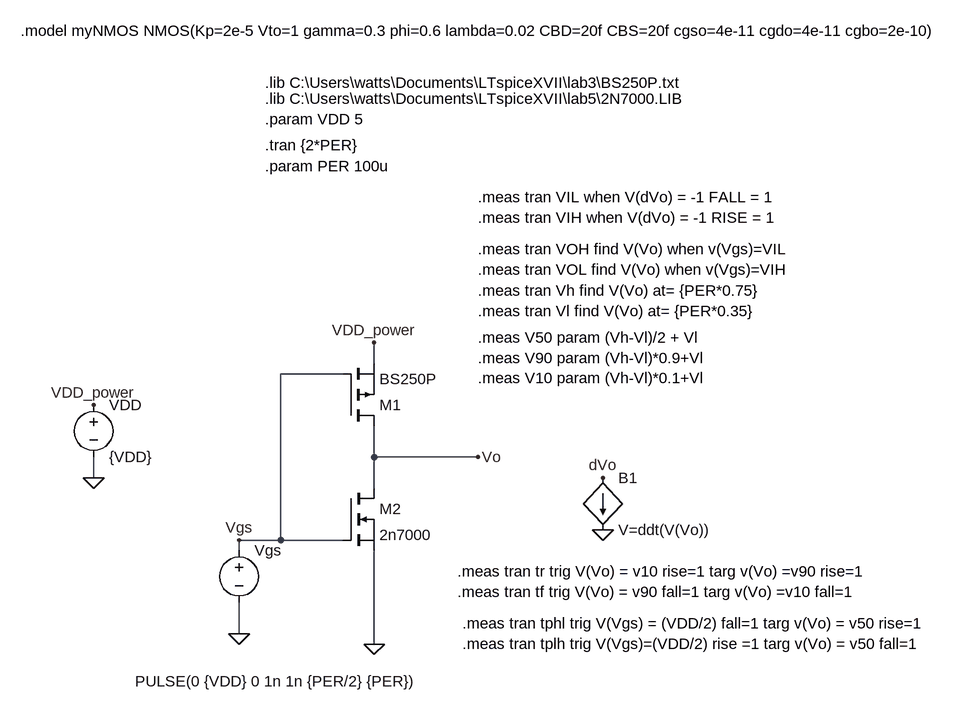
[diagram p0: schematic CMOS_propagation.asc]
CMOS_propagation.asc, the LTspice schematic file:
Version 4
SHEET 1 1272 680
WIRE 272 -96 272 -128
WIRE 224 -80 128 -80
WIRE 272 48 272 0
WIRE 432 48 272 48
WIRE -160 80 -160 48
WIRE 272 96 272 48
WIRE 128 176 128 -80
WIRE 128 176 64 176
WIRE 224 176 128 176
WIRE 64 192 64 176
WIRE 64 320 64 272
WIRE 272 336 272 192
FLAG 64 320 0
FLAG -160 80 0
FLAG -160 -32 VDD_power
FLAG 272 -128 VDD_power
FLAG 432 48 Vo
FLAG 272 336 0
FLAG 624 160 0
FLAG 624 80 dVo
FLAG 64 176 Vgs
SYMBOL voltage 64 176 R0
WINDOW 123 0 0 Left 0
WINDOW 39 0 0 Left 0
WINDOW 3 -160 217 Left 2
SYMATTR Value PULSE(0 {VDD} 0 1n 1n {PER/2} {PER})
SYMATTR InstName Vgs
SYMBOL voltage -160 -48 R0
SYMATTR InstName VDD
SYMATTR Value {VDD}
SYMBOL bi 624 80 R0
SYMATTR InstName B1
SYMATTR Value V=ddt(V(Vo))
SYMBOL nmos 224 96 R0
SYMATTR InstName M2
SYMATTR Value 2n7000
SYMATTR Prefix X
SYMBOL pmos 224 0 M180
SYMATTR InstName M1
SYMATTR Value BS250P
SYMATTR Prefix X
TEXT 104 -504 Left 2 !.lib C:\\Users\\watts\\Documents\\LTspiceXVII\\lab5\\2N7000.LIB
TEXT 104 -472 Left 2 !.param VDD 5
TEXT 104 -432 Left 2 !.tran {2*PER}
TEXT 432 -352 Left 2 !.meas tran VIL when V(dVo) = -1 FALL = 1\n.meas tran VIH when V(dVo) = -1 RISE = 1
TEXT 432 -272 Left 2 !.meas tran VOH find V(Vo) when v(Vgs)=VIL\n.meas tran VOL find V(Vo) when v(Vgs)=VIH
TEXT -272 -608 Left 2 !.model myNMOS NMOS(Kp=2e-5 Vto=1 gamma=0.3 phi=0.6 lambda=0.02 CBD=20f CBS=20f cgso=4e-11 cgdo=4e-11 cgbo=2e-10)
TEXT 432 -208 Left 2 !.meas tran Vh find V(Vo) at= {PER*0.75}\n.meas tran Vl find V(Vo) at= {PER*0.35}
TEXT 432 -136 Left 2 !.meas V50 param (Vh-Vl)/2 + Vl\n.meas V90 param (Vh-Vl)*0.9+Vl\n.meas V10 param (Vh-Vl)*0.1+Vl
TEXT 400 224 Left 2 !.meas tran tr trig V(Vo) = v10 rise=1 targ v(Vo) =v90 rise=1\n.meas tran tf trig V(Vo) = v90 fall=1 targ v(Vo) =v10 fall=1
TEXT 408 304 Left 2 !.meas tran tphl trig V(Vgs) = (VDD/2) fall=1 targ v(Vo) = v50 rise=1\n.meas tran tplh trig V(Vgs)=(VDD/2) rise =1 targ v(Vo) = v50 fall=1
TEXT 104 -400 Left 2 !.param PER 100u
TEXT 104 -528 Left 2 !.lib C:\\Users\\watts\\Documents\\LTspiceXVII\\lab3\\BS250P.txt

The netlist it stands for:
* CMOS_propagation.asc
Vgs Vgs 0 PULSE(0 {VDD} 0 1n 1n {PER/2} {PER})
VDD VDD_power 0 {VDD}
B1 dVo 0 V=ddt(V(Vo))
XM2 Vo Vgs 0 2n7000  ; pins D G S
XM1 Vo Vgs VDD_power BS250P  ; pins D G S
.lib C:\Users\watts\Documents\LTspiceXVII\lab5\2N7000.LIB
.param VDD 5
.tran {2*PER}
.meas tran VIL when V(dVo) = -1 FALL = 1
.meas tran VIH when V(dVo) = -1 RISE = 1
.meas tran VOH find V(Vo) when v(Vgs)=VIL
.meas tran VOL find V(Vo) when v(Vgs)=VIH
.model myNMOS NMOS(Kp=2e-5 Vto=1 gamma=0.3 phi=0.6 lambda=0.02 CBD=20f CBS=20f cgso=4e-11 cgdo=4e-11 cgbo=2e-10)
.meas tran Vh find V(Vo) at= {PER*0.75}
.meas tran Vl find V(Vo) at= {PER*0.35}
.meas V50 param (Vh-Vl)/2 + Vl
.meas V90 param (Vh-Vl)*0.9+Vl
.meas V10 param (Vh-Vl)*0.1+Vl
.meas tran tr trig V(Vo) = v10 rise=1 targ v(Vo) =v90 rise=1
.meas tran tf trig V(Vo) = v90 fall=1 targ v(Vo) =v10 fall=1
.meas tran tphl trig V(Vgs) = (VDD/2) fall=1 targ v(Vo) = v50 rise=1
.meas tran tplh trig V(Vgs)=(VDD/2) rise =1 targ v(Vo) = v50 fall=1
.param PER 100u
.lib C:\Users\watts\Documents\LTspiceXVII\lab3\BS250P.txt
.backanno
.end